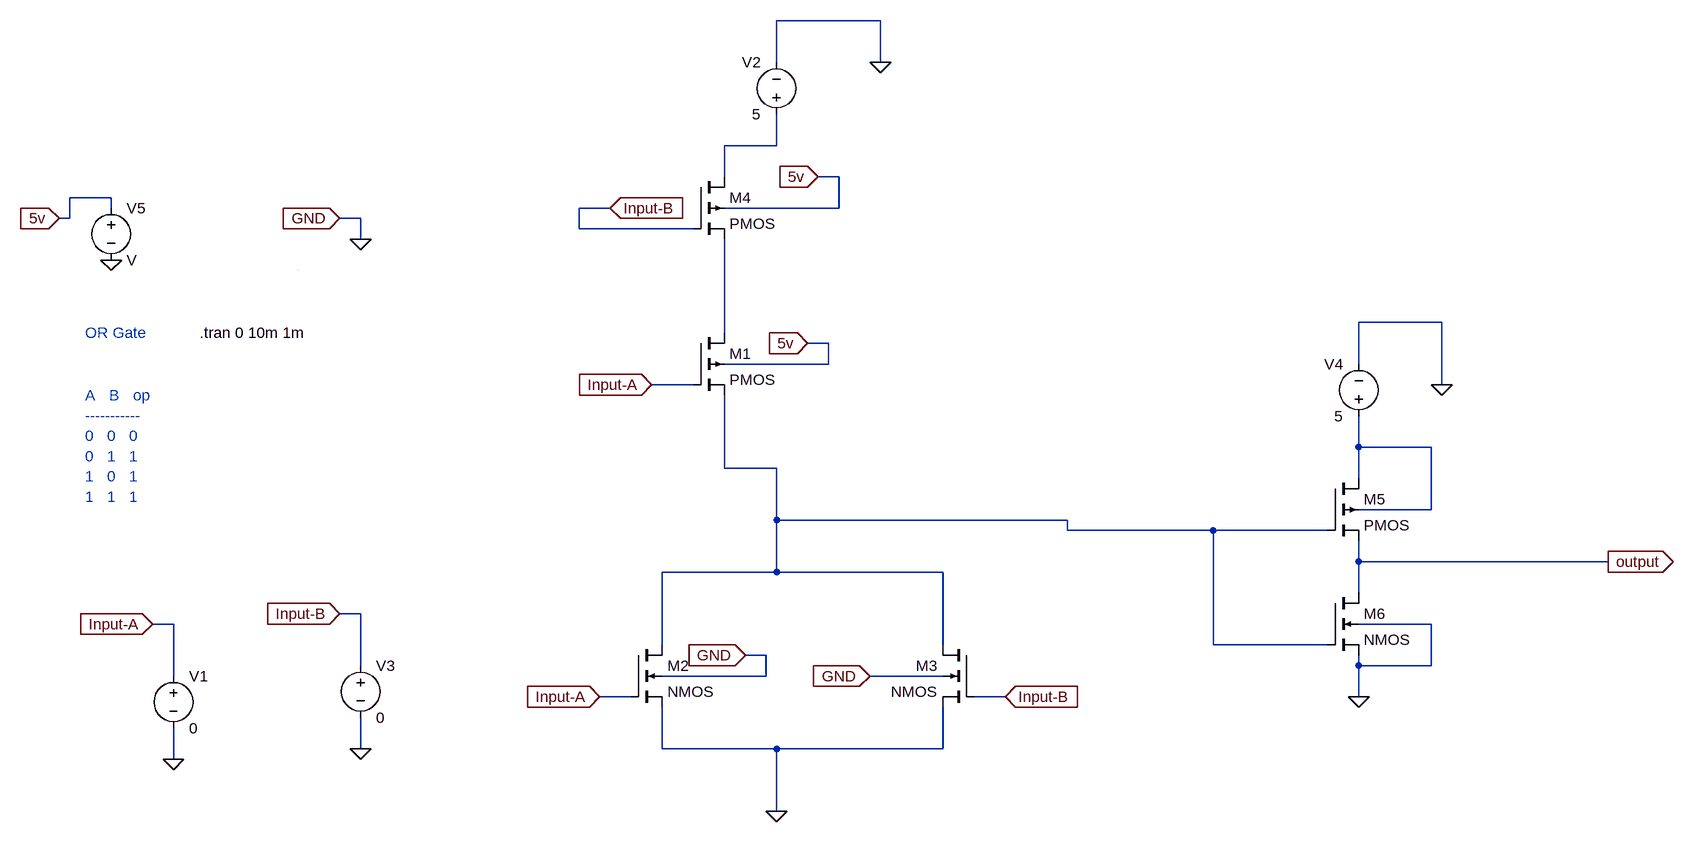
[diagram p0: schematic 5_OR_gate.asc]
5_OR_gate.asc, the LTspice schematic file:
Version 4.1
SHEET 1 2152 852
WIRE 896 -384 736 -384
WIRE 736 -320 736 -384
WIRE 896 -320 896 -384
WIRE 736 -192 736 -240
WIRE 736 -192 656 -192
WIRE 656 -144 656 -192
WIRE 832 -144 800 -144
WIRE -288 -112 -352 -112
WIRE -288 -96 -288 -112
WIRE 480 -96 432 -96
WIRE 832 -96 832 -144
WIRE 832 -96 656 -96
WIRE -352 -80 -352 -112
WIRE -352 -80 -368 -80
WIRE 96 -80 64 -80
WIRE 432 -64 432 -96
WIRE 608 -64 432 -64
WIRE 96 -48 96 -80
WIRE 1760 80 1632 80
WIRE 656 96 656 -48
WIRE 816 112 784 112
WIRE 816 144 816 112
WIRE 816 144 656 144
WIRE 1632 144 1632 80
WIRE 608 176 544 176
WIRE 1760 176 1760 80
WIRE 1632 272 1632 224
WIRE 1744 272 1632 272
WIRE 656 304 656 192
WIRE 736 304 656 304
WIRE 1632 320 1632 272
WIRE 1744 368 1744 272
WIRE 1744 368 1632 368
WIRE 736 384 736 304
WIRE 1184 384 736 384
WIRE 1184 400 1184 384
WIRE 1408 400 1184 400
WIRE 1584 400 1408 400
WIRE 1632 448 1632 416
WIRE 2016 448 1632 448
WIRE 736 464 736 384
WIRE 736 464 560 464
WIRE 992 464 736 464
WIRE 1632 496 1632 448
WIRE 96 528 64 528
WIRE -192 544 -224 544
WIRE 1744 544 1632 544
WIRE 560 576 560 464
WIRE 992 576 992 464
WIRE 1408 576 1408 400
WIRE 1584 576 1408 576
WIRE 720 592 688 592
WIRE 96 608 96 528
WIRE 1632 608 1632 592
WIRE 1744 608 1744 544
WIRE 1744 608 1632 608
WIRE -192 624 -192 544
WIRE 720 624 720 592
WIRE 720 624 560 624
WIRE 992 624 880 624
WIRE 512 656 464 656
WIRE 1088 656 1040 656
WIRE 1632 656 1632 608
WIRE 96 736 96 688
WIRE 560 736 560 672
WIRE 736 736 560 736
WIRE 992 736 992 672
WIRE 992 736 736 736
WIRE -192 752 -192 704
WIRE 736 832 736 736
WIRE 0 0 0 0
FLAG -192 752 0
FLAG 2016 448 output
IOPIN 2016 448 Out
FLAG 896 -320 0
FLAG 736 832 0
FLAG -224 544 Input-A
IOPIN -224 544 In
FLAG 96 736 0
FLAG 64 528 Input-B
IOPIN 64 528 In
FLAG 544 176 Input-A
IOPIN 544 176 In
FLAG 464 656 Input-A
IOPIN 464 656 In
FLAG 1088 656 Input-B
IOPIN 1088 656 In
FLAG 480 -96 Input-B
IOPIN 480 -96 In
FLAG 1632 656 0
FLAG 1760 176 0
FLAG 64 -80 GND
IOPIN 64 -80 In
FLAG 96 -48 0
FLAG -288 -16 0
FLAG -368 -80 5v
IOPIN -368 -80 In
FLAG 800 -144 5v
IOPIN 800 -144 In
FLAG 784 112 5v
IOPIN 784 112 In
FLAG 880 624 GND
IOPIN 880 624 In
FLAG 688 592 GND
IOPIN 688 592 In
SYMBOL pmos4 608 96 R0
SYMATTR InstName M1
SYMBOL nmos4 512 576 R0
SYMATTR InstName M2
SYMBOL voltage -192 608 R0
WINDOW 123 0 0 Left 0
WINDOW 39 0 0 Left 0
SYMATTR InstName V1
SYMATTR Value 0
SYMBOL nmos4 1040 576 M0
SYMATTR InstName M3
SYMBOL pmos4 608 -144 R0
SYMATTR InstName M4
SYMBOL voltage 736 -224 R180
WINDOW 0 24 96 Left 2
WINDOW 3 24 16 Left 2
WINDOW 123 0 0 Left 0
WINDOW 39 0 0 Left 0
SYMATTR InstName V2
SYMATTR Value 5
SYMBOL voltage 96 592 R0
WINDOW 123 0 0 Left 0
WINDOW 39 0 0 Left 0
SYMATTR InstName V3
SYMATTR Value 0
SYMBOL pmos4 1584 320 R0
SYMATTR InstName M5
SYMBOL nmos4 1584 496 R0
SYMATTR InstName M6
SYMBOL voltage 1632 240 R180
WINDOW 0 24 96 Left 2
WINDOW 3 24 16 Left 2
WINDOW 123 0 0 Left 0
WINDOW 39 0 0 Left 0
SYMATTR InstName V4
SYMATTR Value 5
SYMBOL voltage -288 -112 R0
SYMATTR InstName V5
TEXT -152 96 Left 2 !.tran 0 10m 1m
TEXT -328 96 Left 2 ;OR Gate
TEXT -328 192 Left 2 ;A   B   op\n-----------\n0   0   0\n0   1   1\n1   0   1\n1   1   1

The netlist it stands for:
* 5_OR_gate.asc
M1 N002 Input-A N004 5v PMOS
M2 N004 Input-A 0 0 NMOS
V1 Input-A 0 0
M3 N004 Input-B 0 0 NMOS
M4 N001 Input-B N002 5v PMOS
V2 N001 0 5
V3 Input-B 0 0
M5 N003 N004 output N003 PMOS
M6 output N004 0 0 NMOS
V4 N003 0 5
V5 5v 0 V
.model NMOS NMOS
.model PMOS PMOS
.lib standard.mos
.tran 0 10m 1m
* OR Gate
* A   B   op
* -----------
* 0   0   0
* 0   1   1
* 1   0   1
* 1   1   1
.backanno
.end